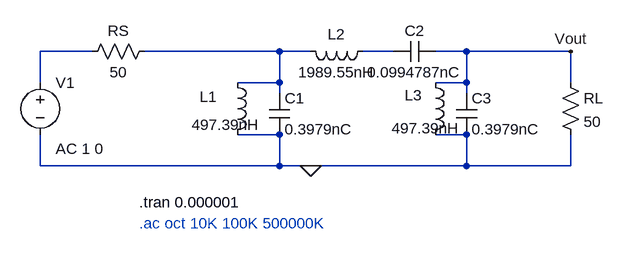
[diagram p0: schematic TransientBandpass.asc]
TransientBandpass.asc, the LTspice schematic file:
Version 4
SHEET 1 1012 680
WIRE 224 192 144 192
WIRE 512 192 304 192
WIRE 560 192 512 192
WIRE 688 192 640 192
WIRE 800 192 752 192
WIRE 960 192 800 192
WIRE 144 240 144 192
WIRE 512 240 512 192
WIRE 512 240 448 240
WIRE 800 240 800 192
WIRE 800 240 752 240
WIRE 960 240 960 192
WIRE 512 256 512 240
WIRE 800 256 800 240
WIRE 512 320 448 320
WIRE 800 320 752 320
WIRE 144 368 144 320
WIRE 512 368 512 320
WIRE 512 368 144 368
WIRE 560 368 512 368
WIRE 800 368 800 320
WIRE 800 368 560 368
WIRE 960 368 960 320
WIRE 960 368 800 368
FLAG 560 368 0
FLAG 960 192 Vout
SYMBOL Voltage 144 224 R0
WINDOW 3 24 96 Invisible 2
WINDOW 123 24 118 Left 2
SYMATTR Value SINE(0 0.7 16Meg)
SYMATTR Value2 AC 1 0
SYMATTR InstName V1
SYMBOL Res 320 176 R90
WINDOW 0 0 56 VBottom 2
WINDOW 3 32 56 VTop 2
SYMATTR InstName RS
SYMATTR Value 50
SYMBOL Cap 496 256 R0
SYMATTR InstName C1
SYMATTR Value 0.3979nC
SYMBOL Cap 784 256 R0
SYMATTR InstName C3
SYMATTR Value 0.3979nC
SYMBOL Ind 656 176 R90
WINDOW 0 5 56 VBottom 2
WINDOW 3 32 56 VTop 2
SYMATTR InstName L2
SYMATTR Value 1989.55nH
SYMBOL Res 944 224 R0
SYMATTR InstName RL
SYMATTR Value 50
SYMBOL ind 736 224 R0
WINDOW 0 -31 35 Left 2
WINDOW 3 -51 86 Left 2
SYMATTR InstName L3
SYMATTR Value 497.39nH
SYMBOL Ind 432 224 R0
WINDOW 0 -43 38 Left 2
WINDOW 3 -55 81 Left 2
SYMATTR InstName L1
SYMATTR Value 497.39nH
SYMBOL Cap 752 176 R90
WINDOW 0 0 32 VBottom 2
WINDOW 3 32 32 VTop 2
SYMATTR InstName C2
SYMATTR Value 0.0994787nC
TEXT 296 456 Left 2 ;.ac oct 10K 100K 500000K
TEXT 296 424 Left 2 !.tran 0.000001

The netlist it stands for:
* TransientBandpass.asc
V1 N001 0 SINE(0 0.7 16Meg) AC 1 0
RS N002 N001 50
C1 N002 0 0.3979nC
C3 Vout 0 0.3979nC
L2 N003 N002 1989.55nH
RL Vout 0 50
L3 Vout 0 497.39nH
L1 N002 0 497.39nH
C2 Vout N003 0.0994787nC
* .ac oct 10K 100K 500000K
.tran 0.000001
.backanno
.end